# EAGLE design so16 (EAGLE 5.11)
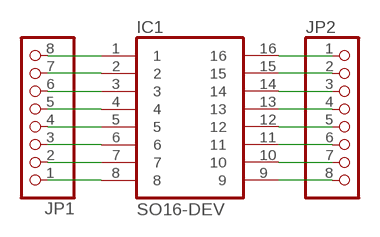
[diagram p0: schematic, sheet 1]

## Parts
IC1  SO16-DEV  [SO16]
JP1  PINHD-1X8  [1X08]
JP2  PINHD-1X8  [1X08]

## Nets
N$1: IC1.1 JP1.8
N$2: IC1.2 JP1.7
N$3: IC1.3 JP1.6
N$4: IC1.4 JP1.5
N$5: IC1.5 JP1.4
N$6: IC1.6 JP1.3
N$7: IC1.7 JP1.2
N$8: IC1.8 JP1.1
N$9: IC1.16 JP2.1
N$10: IC1.15 JP2.2
N$11: IC1.14 JP2.3
N$12: IC1.13 JP2.4
N$13: IC1.12 JP2.5
N$14: IC1.11 JP2.6
N$15: IC1.10 JP2.7
N$16: IC1.9 JP2.8

## Library data of the parts
IC1 = packages:SO16-DEV
JP1 JP2 = pinhead:PINHD-1X8: PIN HEADER

## Board
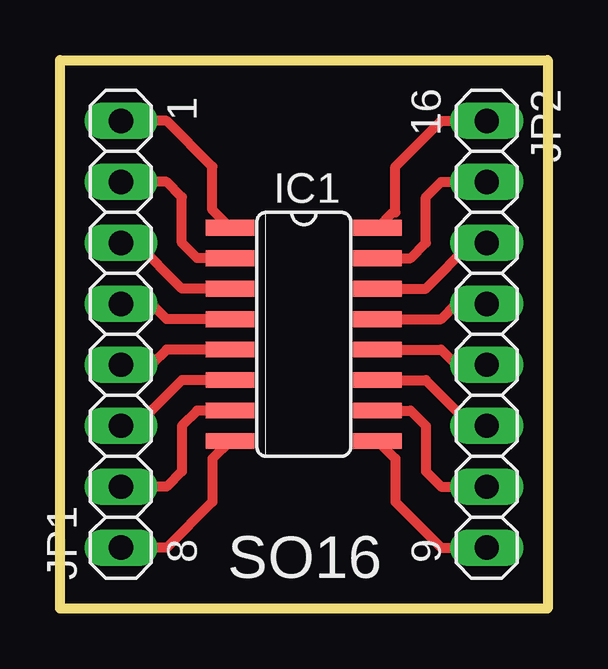
[diagram p1: board, top side]

Size 20.32 x 22.86 mm. Coordinates in mm from the lower left corner, seen from the top.
Outline: 0,22.86 20.32,22.86 20.32,0 0,0 0,22.86
Copper layers (1*16): Top 0.035mm / dielectric 1.5mm / Bottom 0.035mm
Design rules "default": minimum track width 10mil, minimum drill 24mil, track to track 8mil, track to pad 8mil, pad to pad 8mil, via to via 8mil, smd to smd 8mil, copper to edge 40mil, drill to drill 8mil, minimum pad ring 10mil, minimum via ring 8mil, stop-mask expansion 4mil, vias tented up to drill 0mil, thermal gap 10mil

### Footprints (pad centres in the part's own frame; a part is rotated, then mirrored left to right if it is on the bottom)
SO16 = smd 0.66 x 2.032: 1 -4.445,-3.073; 2 -3.175,-3.073; 3 -1.905,-3.073; 4 -0.635,-3.073; 5 0.635,-3.073; 6 1.905,-3.073; 7 3.175,-3.073; 8 4.445,-3.073; 9 4.445,3.073; 10 3.175,3.073; 11 1.905,3.073; 12 0.635,3.073; 13 -0.635,3.073; 14 -1.905,3.073; 15 -3.175,3.073; 16 -4.445,3.073
1X08 = drill 1.016 long: 1 -8.89,0; 2 -6.35,0; 3 -3.81,0; 4 -1.27,0; 5 1.27,0; 6 3.81,0; 7 6.35,0; 8 8.89,0

### Placement (x,y rotation side)
IC1  10.16,11.43 270 top
JP1  2.54,11.43 90 top
JP2  17.78,11.43 270 top

### Tracks (layer width: path | path; a pad name or v marks a point on that pad's centre or on a via)
N$1
  Top 0.406: IC1.1 6.35,16.61 6.35,18.41 4.45,20.32 JP1.8
N$2
  Top 0.406: IC1.2 5.71,14.61 5.08,15.24 5.08,17.14 4.45,17.78 JP1.7
N$3
  Top 0.406: IC1.3 5.08,13.34 3.17,15.24 JP1.6
N$4
  Top 0.406: IC1.4 4.45,12.06 3.81,12.7 JP1.5
N$5
  Top 0.406: IC1.5 4.45,10.79 3.81,10.16 JP1.4
N$6
  Top 0.406: IC1.6 5.08,9.53 3.17,7.62 JP1.3
N$7
  Top 0.406: IC1.7 5.71,8.26 5.08,7.62 5.08,5.71 4.45,5.08 JP1.2
N$8
  Top 0.406: IC1.8 6.35,6.25 6.35,4.45 4.45,2.54 JP1.1
N$9
  Top 0.406: IC1.16 13.87,16.51 13.97,16.51 13.97,18.41 15.88,20.32 JP2.1
N$10
  Top 0.406: IC1.15 14.61,14.61 15.24,15.24 15.24,17.14 15.88,17.78 JP2.2
N$11
  Top 0.406: IC1.14 15.24,13.34 17.14,15.24 JP2.3
N$12
  Top 0.406: IC1.13 15.88,12.06 16.51,12.7 JP2.4
N$13
  Top 0.406: IC1.12 15.88,10.79 16.51,10.16 JP2.5
N$14
  Top 0.406: IC1.11 15.24,9.53 17.14,7.62 JP2.6
N$15
  Top 0.406: IC1.10 14.61,8.26 15.24,7.62 15.24,5.71 15.88,5.08 JP2.7
N$16
  Top 0.406: IC1.9 13.97,6.25 13.97,4.45 15.88,2.54 JP2.8

### Text on the board
tPlace: 1 | 16 | 8 | 9 | SO16